# EasyEDA Pro project PCB.epro

# Board PCB2
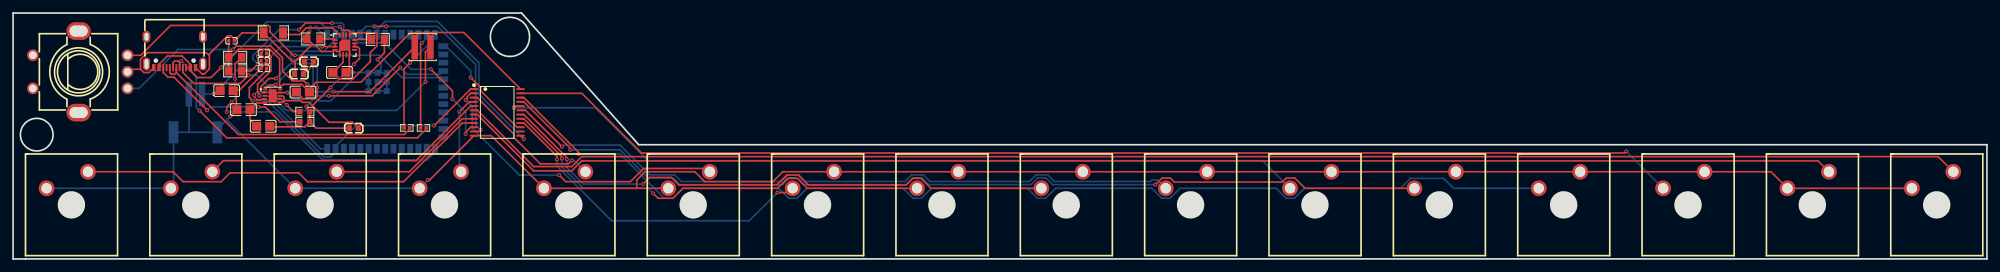
[diagram p0: board, top side]
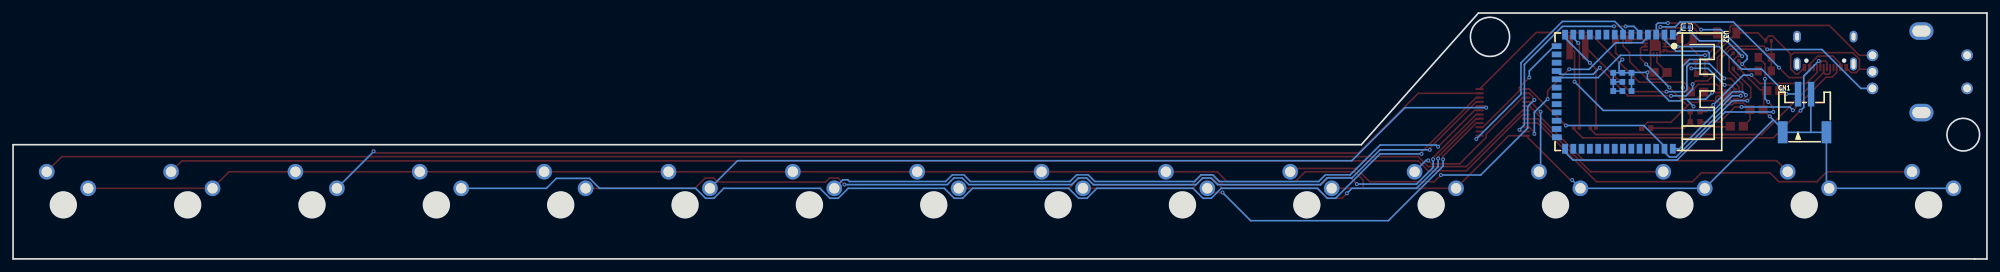
[diagram p1: board, bottom side, seen from below]

Outline 302.39 x 37.72 mm; copper layers: Top Layer, Bottom Layer. Coordinates in mm from the lower left corner of the outline.
Outline path: circle c3.63,19.06 r2.5 ; circle c76.13,34.06 r3 ; 0,37.72 0,0 1.91,0 1.91,0.01 302.39,0.01 302.39,17.53 95.84,17.53 77.9,37.72 0,37.72
Stack: Top Layer 0.035mm / Dielectric1 1.51mm FR4 er 4.5 / Bottom Layer 0.035mm

## Design rules (mm)
template: JLCPCB Capability(Two Layers Board)
spacing copperThickness1oz (default): track to track 0.102, other pairs 0.152 to 0.3
spacing copperThickness2oz: track to track 0.203, other pairs 0.152 to 0.3
track width copperThickness1oz (default): min 0.127, default 0.254, max 2.54
track width copperThickness2oz: min 0.203, default 0.254, max 2.54
differential pair differentialPair (default): width min 0.127, default 0.254, max 2.54; gap min 0.152, default 0.152
via viaSize (default): diameter min 0.5, default 0.61, max 10; hole min 0.3, default 0.305, max 6.3

## Placement (name value [footprint] x y rotation side)
C1  10uF  [C0805]  50 28.61 0 top
C3  22uF  [C0805]  32.73 25.82 0 top
C4  22uF  [C0805]  35.29 22.89 180 top
C5  10uF  [C0603]  52.2 20.07 0 top
C6  100nF  [C0805]  38.32 20.36 0 top
C7  10uF  [C0603]  45.33 30.25 180 top
C8  10uF  [C0603]  43.81 28.36 180 top
C9  1uF  [C0402]  38.43 30.4 0 top
C10  10uF  [C0805]  44.41 25.59 0 top
C11  100nF  [C0402]  45.97 35.56 0 bottom
C12  100nF  [C0402]  38.44 31.57 0 top
C13  100nF  [C0402]  33.46 33.46 0 top
C14  100nF  [C0402]  38.43 29.23 0 top
CN1  S2B-PH-SM4-TB(LF)(SN)  [CONN-SMD_P2.00_S2B-PH-SM4-TB-LF-SN]  27.94 22.35 180 bottom
L1  1.5uH  [IND-SMD_L4.0-W4.0-A]  62.74 32.51 0 top
R1  5.1kΩ  [R0603]  44.7 22.61 0 top
R2  5.1kΩ  [R0603]  44.7 21.03 0 top
R3  10kΩ  [R0805]  45.99 33.75 180 top
R4  3.09kΩ  [R0805]  55.88 33.67 0 top
R5  1.78kΩ  [R1206]  39.88 34.67 0 top
R6  10kΩ  [R0805]  34.04 28.85 180 top
R7  10kΩ  [R0805]  34.02 30.92 0 top
R8  22Ω  [R0402]  62.87 20.1 0 top
R9  22Ω  [R0402]  60.33 20.1 0 top
SW1  EC11E1834403  [SW-TH_EC11E1820402]  10.29 28.7 90 top
SW6  CPG1511F01S04  [KEY-TH_CPG1511F01S0X]  198.8 12.11 0 top
SW7  CPG1511F01S04  [KEY-TH_CPG1511F01S0X]  217.85 12.11 0 top
SW8  CPG1511F01S04  [KEY-TH_CPG1511F01S0X]  236.9 12.11 0 top
SW9  CPG1511F01S04  [KEY-TH_CPG1511F01S0X]  255.95 12.11 0 top
SW18  CPG1511F01S04  [KEY-TH_CPG1511F01S0X]  122.61 12.11 0 top
SW19  CPG1511F01S04  [KEY-TH_CPG1511F01S0X]  141.65 12.11 0 top
SW20  CPG1511F01S04  [KEY-TH_CPG1511F01S0X]  160.7 12.11 0 top
SW21  CPG1511F01S04  [KEY-TH_CPG1511F01S0X]  179.75 12.11 0 top
SW22  CPG1511F01S04  [KEY-TH_CPG1511F01S0X]  27.36 12.11 0 top
SW23  CPG1511F01S04  [KEY-TH_CPG1511F01S0X]  65.45 12.11 0 top
SW24  CPG1511F01S04  [KEY-TH_CPG1511F01S0X]  84.5 12.11 0 top
SW25  CPG1511F01S04  [KEY-TH_CPG1511F01S0X]  103.56 12.11 0 top
SW26  CPG1511F01S04  [KEY-TH_CPG1511F01S0X]  8.3 12.11 0 top
SW27  CPG1511F01S04  [KEY-TH_CPG1511F01S0X]  46.41 12.11 0 top
SW28  CPG1511F01S04  [KEY-TH_CPG1511F01S0X]  275 12.11 0 top
SW29  CPG1511F01S04  [KEY-TH_CPG1511F01S0X]  294.06 12.11 0 top
U17  CD74HC4067SM96  [SSOP-24_L8.1-W5.3-P0.65-LS7.8-BL]  74.17 22.48 270 top
U32  ESP32-S3-WROOM-1-N16R8  [WIRELM-SMD_ESP32-S3-WROOM-1]  57.02 25.65 270 bottom
U33  BQ24074RGTR  [QFN-16_L3.0-W3.0-P0.50-TL-EP1.7]  50.81 32.82 0 top
U34  TPS63031DSKR  [SON-10_L2.5-W2.5-P0.50-TL-EP]  39.75 25.02 0 top
USB1  TYPE-C 16PIN 2MD(073)  [USB-C-SMD_TYPE-C-6PIN-2MD-073]  24.77 31.72 180 top

## Footprints (pads in the part's own frame, mm; a bottom-side part is the same pattern mirrored in y, then rotated)
C0402
  rect 0.5x0.54 smd: 1(-0.42,0) 2(0.42,0)
C0603
  rect 0.8x0.9 smd: 1(-0.7,0) 2(0.7,0)
C0805
  rect 1.41x1.35 smd: 1(-1,0)
  rect 1.397x1.346 smd: 2(1,0)
CONN-SMD_P2.00_S2B-PH-SM4-TB-LF-SN
  rect 1x3.8 smd: 1(-1,2.925) 2(1,2.925)
  rect 1.5x3.4 smd: 3(3.35,-2.925) 4(-3.35,-2.925)
IND-SMD_L4.0-W4.0-A
  rect 1x3.8 smd: 1(-1.2,0) 2(1.2,0)
KEY-TH_CPG1511F01S0X
  round 2.4 hole 1.6: 1(-3.175,-1.27) 2(3.175,1.27)
QFN-16_L3.0-W3.0-P0.50-TL-EP1.7
  oval 0.85x0.28 smd: 1(-1.5,0.75) 2(-1.5,0.25) 3(-1.5,-0.25) 4(-1.5,-0.75) 9(1.5,-0.75) 10(1.5,-0.25) 11(1.5,0.25) 12(1.5,0.75)
  oval 0.28x0.85 smd: 5(-0.75,-1.5) 6(-0.25,-1.5) 7(0.25,-1.5) 8(0.75,-1.5) 13(0.75,1.5) 14(0.25,1.5) 15(-0.25,1.5) 16(-0.75,1.5)
  custom 1.7x1.7 smd: 17(0,0)
R0402
  rect 0.566x0.54 smd: 1(-0.433,0) 2(0.433,0)
R0603
  rect 0.806x0.864 smd: 1(-0.753,0) 2(0.753,0)
R0805
  rect 1.133x1.377 smd: 1(-1,0) 2(1,0)
R1206
  rect 1.208x1.701 smd: 1(-1.479,0) 2(1.479,0)
SON-10_L2.5-W2.5-P0.50-TL-EP
  rect 0.665x0.28 smd: 1(-1.157,1) 2(-1.157,0.5) 3(-1.157,0) 4(-1.157,-0.5) 5(-1.157,-1) 6(1.157,-1) 7(1.157,-0.5) 8(1.157,0) 9(1.157,0.5) 10(1.157,1)
  rect 1.2x2 smd: 11(0,0)
SSOP-24_L8.1-W5.3-P0.65-LS7.8-BL
  oval 0.308x1.324 smd: 1(-3.575,-3.562) 2(-2.925,-3.562) 3(-2.275,-3.562) 4(-1.625,-3.562) 5(-0.975,-3.562) 6(-0.325,-3.562) 7(0.325,-3.562) 8(0.975,-3.562) 9(1.625,-3.562) 10(2.275,-3.562) 11(2.925,-3.562) 12(3.575,-3.562) 13(3.575,3.562) 14(2.925,3.562) 15(2.275,3.562) 16(1.625,3.562) 17(0.975,3.562) 18(0.325,3.562) 19(-0.325,3.562) 20(-0.975,3.562) 21(-1.625,3.562) 22(-2.275,3.562) 23(-2.925,3.562) 24(-3.575,3.562)
SW-TH_EC11E1820402
  round 1.8 hole 1.2: A(-2.54,-7.25) B(2.54,-7.25) C(0,-7.25) D(-2.54,7.25) E(2.54,7.25)
  oval 2.7x3.7 hole 1.7x2.8: F(6.25,0.25) G(-6.25,0.25)
USB-C-SMD_TYPE-C-6PIN-2MD-073
  rect 0.55x1.1 smd: 1(-3.2,2.375) 2(-2.4,2.375) 11(2.4,2.375) 12(3.2,2.375)
  rect 0.3x1.1 smd: 3(-1.75,2.375) 4(-1.25,2.375) 5(-0.75,2.375) 6(-0.25,2.375) 7(0.25,2.375) 8(0.75,2.375) 9(1.25,2.375) 10(1.75,2.375)
  oval 1.1x2 hole 0.6x1.5: 13(-4.325,1.825) 14(4.325,1.825)
  oval 1.2x1.8 hole 0.6x1.2: 13(-4.325,-2.375) 14(4.325,-2.375)
WIRELM-SMD_ESP32-S3-WROOM-1
  rect 1.5x0.9 smd: 1(-8.75,8.895) 2(-8.75,7.625) 3(-8.75,6.355) 4(-8.75,5.085) 5(-8.75,3.815) 6(-8.75,2.545) 7(-8.75,1.275) 8(-8.75,0.005) 9(-8.75,-1.265) 10(-8.75,-2.535) 11(-8.75,-3.805) 12(-8.75,-5.075) 13(-8.75,-6.345) 14(-8.75,-7.615) 27(8.75,-7.615) 28(8.75,-6.345) 29(8.75,-5.075) 30(8.75,-3.805) 31(8.75,-2.535) 32(8.75,-1.265) 33(8.75,0.005) 34(8.75,1.275) 35(8.75,2.545) 36(8.75,3.815) 37(8.75,5.085) 38(8.75,6.355) 39(8.75,7.625) 40(8.75,8.895)
  rect 0.9x1.5 smd: 15(-6.985,-8.895) 16(-5.715,-8.895) 17(-4.445,-8.895) 18(-3.175,-8.895) 19(-1.905,-8.895) 20(-0.635,-8.895) 21(0.635,-8.895) 22(1.905,-8.895) 23(3.175,-8.895) 24(4.445,-8.895) 25(5.715,-8.895) 26(6.985,-8.865)
  rect 0.9x0.9 smd: 41(-2.9,-0.225) 41(-2.9,1.175) 41(-2.9,2.575) 41(-1.5,-0.225) 41(-1.5,1.175) 41(-1.5,2.575) 41(-0.1,-0.225) 41(-0.1,1.175) 41(-0.1,2.575)

## Nets
3V3: C10.2 C13.1 R6.2 R7.1 U17.24 U34.10
GND: C1.2 C3.2 C4.2 C5.1 C6.2 C8.2 C9.2 C11.1 C12.1 C13.2 C14.1 CN1.2 CN1.3 CN1.4 R1.2 R2.2 R3.2 R4.2 R5.1 SW1.C SW6.2 SW7.2 SW8.2 SW9.2 SW18.2 SW19.2 SW20.2 SW21.2 SW22.1 SW23.1 SW24.1 SW25.1 SW26.1 SW27.1 SW28.1 SW29.1 U17.12 U32.41 U33.4 U33.5 U33.8 U33.17 U34.7 U34.9 U34.11 USB1.1 USB1.12
VBAT: C3.1 CN1.1 U33.2 U33.3
VBUS_5V: C1.1 U33.6 U33.13 USB1.2 USB1.11
ADC1: C14.2 U17.1 U32.39
E#: U17.15 U32.15
S0: U17.10 U32.4
S1: U17.11 U32.5
S2: U17.14
S3: U17.13 U32.7
SYS_4V4: C4.1 C5.2 C6.1 U33.10 U33.11 U34.5 U34.6 U34.8
USB_D+: R9.2 USB1.6 USB1.8
USB_D-: R8.2 USB1.5 USB1.7
$1N6548: R1.1 USB1.4
$1N6587: R2.1 USB1.10
$1N7885: R3.1 U33.1
$1N8001: R4.1 U33.12
$1N8056: R5.2 U33.16
$1N9422: L1.2 U34.4
$1N9428: L1.1 U34.2
$1N9438: U34.3
$1N9444: C7.1 U34.1
$1N9768: C7.2 C8.1
$1N10076: C9.1 R6.1 U32.3
$1N10174: R7.2 U32.27
$1N11262: C10.1 U32.2
$1N11304: C11.2 U32.1
$1N11378: R8.1 U32.13
$1N11417: R9.1 U32.14
$1N11588: U32.6
$1N11672: C12.2 U32.40
$1N13367: SW1.A U32.18
$1N13382: SW1.B U32.19
$1N17155: SW26.2 U17.9
$1N17161: SW27.2 U17.8
$1N17168: SW28.2 U17.7
$1N17175: SW29.2 U17.6
$1N17188: SW25.2 U17.2
$1N17194: SW24.2 U17.3
$1N17201: SW23.2 U17.4
$1N17208: SW22.2 U17.5
$1N17215: SW9.1 U17.23
$1N17222: SW8.1 U17.22
$1N17229: SW7.1 U17.21
$1N17252: SW6.1 U17.20
$1N17260: SW21.1 U17.19
$1N17269: SW18.1 U17.16
$1N17275: SW19.1 U17.17
$1N17282: SW20.1 U17.18

Pads without a net: SW1 D E F G; U32 8 9 10 11 12 16 17 20 21 22 23 24 25 26 28 29 30 31 32 33 34 35 36 37 38; U33 7 9 14 15; USB1 3 9 13 14

## Via types
v1: diameter 0.61, hole 0.305, Top Layer to Bottom Layer, 67 vias

## Routing (per net, layer and track width the routed paths; a pad name or vN(x,y) marks a point on that pad's centre or on a via; arc(x,y) is an arc through that point)
3V3: length 63.4
  Top Layer w0.254: 33.04,31.16 33.04,33.46 ; 33.04,31.16 33.54,31.16 34.56,32.18 39.32,32.18 40.84,30.66 40.84,26.59 40.91,26.53 40.91,26.27 ; 33.04,31.16 33.04,30.91 ; 40.91,26.27 41.42,26.78 44.22,26.78 C10.2 45.41,26.1 46.43,27.11 53.29,27.11 60.91,34.73 69.05,34.73 U17.24 ; 40.91,26.27 U34.10 ; 33.04,30.91 R7.1 ; 33.04,30.91 R6.2
GND: length 458.7
  Top Layer w0.254: SW1.C 17.93,29.1 19.53,29.1 ; 95.55,10.84 95.55,12.11 96.82,13.38 104.44,13.38 105.97,11.85 116.38,11.85 117.91,13.38 SW18.2 SW19.2 SW20.2 SW21.2 SW6.2 SW7.2 SW8.2 SW9.2 269.29,13.38 SW28.1 SW29.1 ; 95.55,10.84 SW24.1 73.26,18.9 U17.12 63.81,12.11 v1(63.55,12.11) ; 95.55,10.84 SW25.1 ; v1(44.95,23.4) 44.95,23.11 R1.2 R2.2 ; v1(55.85,30.59) 56.88,31.62 R4.2 ; 50.03,31.83 50.03,31.35 50.06,31.32 ; 50.03,31.83 49.55,31.83 U33.4 49.05,31.82 47.28,31.82 46.26,32.83 46.01,32.83 ; 50.03,31.83 50.29,32.08 50.8,32.08 ; 34.2,25.93 34.2,22.99 C4.2 v1(33.28,21.88) ; 34.2,25.93 33.84,25.93 C3.2 ; 34.2,25.93 34.71,25.93 C14.1 38.01,29.31 38.77,30.07 38.77,30.32 ; 19.53,29.1 20.04,28.59 20.8,28.59 USB1.12 ; 19.53,29.1 19.53,30.62 20.55,31.64 29.61,31.64 30.07,31.18 ; 30.07,31.18 30.07,29.14 29.31,28.38 28.93,28.38 USB1.1 ; 30.07,31.18 30.07,31.43 32.87,34.22 33.37,34.22 33.88,33.72 C13.2 35.09,34.67 R5.1 42.78,30.29 43.21,30.29 ; U34.11 39.76,25.01 40.29,25.01 ; 38.77,30.32 38.77,30.58 38.27,31.08 38.01,31.08 ; 38.77,30.32 C9.2 ; v1(45.35,34.77) 45.09,34.51 45.09,33.75 ; 38.01,31.08 38.01,31.57 ; 38.01,31.08 v1(37.51,31.08) ; R2.2 44.7,20.27 39.4,20.27 C6.2 ; R2.2 46.42,20.07 C5.1 ; 46.01,32.83 45.09,33.75 ; 46.01,32.83 45.75,32.83 43.21,30.29 ; 45.09,33.75 R3.2 ; 43.21,30.29 43.21,28.46 C8.2 ; C1.2 51.51,29.12 ; 51.51,29.12 51.51,31.27 51.56,31.32 51.56,31.83 51.3,32.08 50.8,32.08 ; 51.51,29.12 v1(52.02,28.61) ; 50.8,32.08 50.8,32.81 U33.17 ; 40.29,25.01 40.29,24.76 40.54,24.5 40.89,24.5 U34.7 ; 40.29,25.01 40.29,25.37 40.44,25.52 U34.9 v1(42.07,25.52)
  Bottom Layer w0.254: U32.41 U32.41 U32.41 ; U32.41 54.39,28.61 v1(52.02,28.61) 52.02,27.59 48.67,24.25 46.89,24.25 46.64,24.5 45.88,24.5 ; U32.41 U32.41 56.36,28.55 ; 26.97,19.43 CN1.4 31.29,19.89 32.77,21.37 ; 26.97,19.43 26.97,25.25 CN1.2 ; 26.97,19.43 CN1.3 24.59,11.25 SW22.1 SW26.1 ; U32.41 U32.41 U32.41 ; U32.41 U32.41 ; U32.41 U32.41 56.36,28.55 ; 32.77,21.37 32.77,21.3 SW27.1 SW23.1 v1(63.55,12.11) ; 32.77,21.37 v1(33.28,21.88) ; 56.36,28.55 56.36,30.08 v1(55.85,30.59) ; v1(42.07,25.52) 43.08,24.5 45.88,24.5 ; 45.88,24.5 45.88,24.33 v1(44.95,23.4) ; v1(37.51,31.08) 39.87,33.45 44.03,33.45 45.55,34.97 C11.1
VBAT: length 25.1
  Top Layer w0.254: v1(47.37,32.57) 49.31,32.57 U33.2 ; C3.1 31.22,25.31 v1(30.71,25.31)
  Bottom Layer w0.254: CN1.1 28.97,25.31 v1(30.71,25.31) 34.52,29.12 37.57,29.12 41.02,32.57 v1(47.37,32.57)
VBUS_5V: length 56.6
  Top Layer w0.254: 50.56,31.32 50.56,30.17 C1.1 50.02,27.59 52.05,27.59 54.73,30.28 54.73,31.66 55.75,32.67 55.75,34.56 55.6,34.71 51.94,34.71 51.56,34.32 51.56,34.83 51.3,35.08 50.54,35.08 v1(50.03,35.59) ; 22.36,29.35 22.36,29.86 23.64,31.13 25.89,31.13 27.16,29.86 USB1.2 27.16,28.84 28.18,27.83 30.33,27.83 v1(31.85,29.35)
  Bottom Layer w0.254: v1(31.85,29.35) 38.86,36.35 46.99,36.35 47.75,35.59 v1(50.03,35.59)
ADC1: length 48.6
  Top Layer w0.254: v1(36.7,24.27) 36.19,24.78 36.19,26.3 38.85,28.97 C14.2 ; U17.1 70.1,26.05 v1(64.51,20.47)
  Bottom Layer w0.254: v1(64.51,20.47) 52.57,20.47 49.52,17.42 49.52,17.03 U32.39 49.4,16.4 48.64,15.63 47.62,15.63 38.98,24.27 v1(36.7,24.27)
E#: length 17.9
  Top Layer w0.254: v1(70.11,27.82) 71.63,26.3 71.63,25.79 77.22,20.2 U17.15
  Bottom Layer w0.254: U32.15 65.93,32.65 66.3,32.65 70.11,28.84 v1(70.11,27.82)
S0: length 28.4
  Top Layer w0.254: v1(67.3,24.52) 67.3,25.79 v1(64,29.09) ; U17.10 70.1,20.2 69.34,19.44 v1(69.34,19.19)
  Bottom Layer w0.254: U32.4 51.94,34.05 52.83,33.16 56.89,33.16 60.95,29.09 v1(64,29.09) ; v1(69.34,19.19) 69.34,22.49 v1(67.3,24.52)
S1: length 32.3
  Top Layer w0.254: U17.11 71.37,19.55 v1(71.62,19.81) ; v1(57.14,35.67) v1(55.37,35.67)
  Bottom Layer w0.254: U32.5 53.33,34.53 53.33,34.91 54.1,35.67 v1(55.37,35.67) ; v1(57.14,35.67) 65.02,35.67 70.86,29.83 70.86,20.57 v1(71.62,19.81)
S3: length 34.8
  Top Layer w0.254: U17.13 v1(78.24,18.4)
  Bottom Layer w0.254: v1(78.24,18.4) 71.38,25.25 71.38,30.08 65.03,36.43 57.01,36.43 55.75,35.17 U32.7
SYS_4V4: length 36.7
  Top Layer w0.254: 38.49,23.91 U34.5 ; 38.49,23.91 37.31,23.91 C4.1 36.29,21.38 C6.1 ; 38.49,23.91 38.74,23.91 38.99,23.66 40.52,23.66 40.77,23.91 40.77,24.02 41.28,24.02 41.53,24.27 ; 41.53,24.27 41.53,24.78 41.3,25.02 U34.8 ; 41.53,24.27 44.07,24.27 44.33,24.02 45.34,24.02 45.85,23.51 ; v1(52.2,29.86) 53.07,30.73 53.07,32.25 52.75,32.57 52.31,32.57 U33.11 ; 45.85,23.51 48.39,20.97 51.99,20.97 52.9,20.07 ; 45.85,23.51 v1(48.65,26.3)
  Bottom Layer w0.254: v1(48.65,26.3) v1(52.2,29.86)
USB_D+: length 42.9
  Top Layer w0.254: USB1.8 24.02,28.57 24.25,28.33 24.76,28.33 25.02,28.59 ; R9.2 60.76,19.93 59.92,19.09 34.52,19.09 25.02,28.59 ; 25.02,28.59 USB1.6
USB_D-: length 49.1
  Top Layer w0.254: USB1.5 25.52,30.11 ; 25.52,30.11 25.26,30.37 24.75,30.37 24.52,30.13 USB1.7 ; 25.52,30.11 v1(25.77,30.37) ; v1(28.56,22.75) 32.73,18.58 61.94,18.58 63.3,19.94 63.3,20.1
  Bottom Layer w0.254: v1(28.56,22.75) 28.05,23.25 28.05,28.08 v1(25.77,30.37)
$1N6548: length 22.2
  Top Layer w0.254: v1(41.92,23.62) 42.93,22.61 R1.1 ; USB1.4 26.02,28.6 27.69,26.92 34.81,26.92 v1(36.08,28.19)
  Bottom Layer w0.254: v1(36.08,28.19) 37.35,28.19 v1(41.92,23.62)
$1N6587: length 25.2
  Top Layer w0.254: v1(37.6,23.31) 38.62,23.31 40.9,21.03 43.95,21.03 ; v1(29.73,22.81) 24.65,27.89 23.72,27.89 23.02,28.59 USB1.10
  Bottom Layer w0.254: v1(37.6,23.31) 30.23,23.31 v1(29.73,22.81)
$1N7885: length 2.4
  Top Layer w0.254: R3.1 49.13,33.75 49.31,33.57
$1N8001: length 2.6
  Top Layer w0.254: R4.1 52.41,33.67 52.31,33.57
$1N8056: length 9.7
  Top Layer w0.254: 50.06,34.32 48.95,35.43 44.91,35.43 43.9,34.42 41.61,34.42 R5.2
$1N9422: length 37.3
  Top Layer w0.254: v1(36.93,25.15) 36.93,24.89 37.44,24.38 37.95,24.38 38.09,24.52 U34.4 ; v1(63.18,27.18) 63.18,31.75 L1.2
  Bottom Layer w0.254: v1(36.93,25.15) 37.44,25.65 38.97,25.65 41.84,22.78 58.78,22.78 v1(63.18,27.18)
$1N9428: length 33.2
  Top Layer w0.254: v1(40.25,27.69) 39.24,27.69 37.97,26.42 37.97,25.65 38.1,25.52 U34.2 ; L1.1 54.68,25.65 v1(49.09,25.65)
  Bottom Layer w0.254: v1(40.25,27.69) 42.54,29.97 45.54,29.97 45.97,29.54 45.97,25.98 46.3,25.65 v1(49.09,25.65)
$1N9444: length 9.3
  Top Layer w0.254: v1(40.19,26.69) 39.26,26.69 U34.1 ; C7.1 46.03,29.99 v1(45.27,29.23)
  Bottom Layer w0.254: v1(45.27,29.23) 42.73,29.23 v1(40.19,26.69)
$1N9768: length 1.9
  Top Layer w0.254: C8.1 44.63,28.48 C7.2
$1N10076: length 22.8
  Top Layer w0.254: R6.1 36.46,28.85 v1(37.5,29.89) C9.1 ; v1(43.79,35.17) 44.81,36.18 v1(48.87,36.18)
  Bottom Layer w0.254: v1(37.5,29.89) 36.74,30.65 36.74,31.16 40.74,35.17 v1(43.79,35.17) ; v1(48.87,36.18) 50.4,36.18 50.65,35.93 50.65,34.42 U32.3
$1N10174: length 45.3
  Top Layer w0.254: v1(32.74,22.54) 32.74,23.3 v1(33.5,24.07) ; R7.2 34.01,29.91 v1(34.01,27.62)
  Bottom Layer w0.254: v1(33.5,24.07) 34.01,24.57 v1(34.01,27.62) ; v1(32.74,22.54) 40.1,22.54 47.47,15.18 63.42,15.18 64.64,16.4 U32.27
$1N11262: length 22.2
  Top Layer w0.254: v1(46.6,26.28) 46.6,25.01 46.17,24.57 44.43,24.57 C10.1
  Bottom Layer w0.254: U32.2 49.4,33.64 47.62,31.86 42.79,31.86 42.54,31.61 42.54,30.85 42.79,30.59 45.59,30.59 46.6,29.58 v1(46.6,26.28)
$1N11304: length 2.2
  Bottom Layer w0.254: C11.2 47.55,34.4 U32.1
$1N11378: length 14.7
  Top Layer w0.254: v1(62.61,33.13) 62.44,32.97 R8.1
  Bottom Layer w0.254: v1(62.61,33.13) 63.37,33.9 U32.13
$1N11417: length 16.3
  Top Layer w0.254: R9.1 59.9,29.15 v1(60.83,30.09)
  Bottom Layer w0.254: v1(60.83,30.09) 64.64,33.9 U32.14
$1N11672: length 21.5
  Top Layer w0.254: v1(37.71,25.03) 37.71,25.29 37.46,25.54 37.46,26.81 39.49,28.84 39.49,30.93 C12.2
  Bottom Layer w0.254: U32.40 47.11,16.9 38.98,25.03 v1(37.71,25.03)
$1N13367: length 58.3
  Top Layer w0.254: v1(45.09,26.8) 44.58,27.3 42.8,27.3 41.28,28.83 41.28,30.86 39.5,32.64 34.17,32.64 v1(33.66,32.13) ; v1(59.31,29.34) 55,25.02 v1(48.39,25.02)
  Bottom Layer w0.254: v1(45.09,26.8) 45.09,26.03 46.11,25.02 v1(48.39,25.02) ; SW1.A 19.31,26.16 25.28,32.13 v1(33.66,32.13) ; U32.18 65.41,28.32 60.33,28.32 v1(59.31,29.34)
$1N13382: length 54.1
  Top Layer w0.254: SW1.B 19.56,31.24 24.14,35.81 39.12,35.81 39.38,35.56 39.38,34.8 42.93,31.24 v1(43.19,31.24)
  Bottom Layer w0.254: v1(43.19,31.24) 56.14,31.24 59.57,27.81 65.66,27.81 U32.19
$1N17155: length 64.6
  Top Layer w0.254: SW26.2 24.52,13.38 26.05,11.85 31.89,11.85 33.23,13.2 43.75,13.2 45.1,11.85 59.83,11.85 68.83,20.85 U17.9
$1N17161: length 24.4
  Top Layer w0.254: 49.58,13.38 60.7,13.38 68.83,21.5 U17.8
$1N17168: length 212.5
  Top Layer w0.254: SW28.2 276.52,15.04 87.12,15.04 85.59,13.52 79.75,13.52 71.11,22.15 U17.7
$1N17175: length 231.8
  Top Layer w0.254: SW29.2 294.92,15.69 87.12,15.69 85.59,14.17 79.75,14.17 71.11,22.8 U17.6
$1N17188: length 47.4
  Top Layer w0.254: SW25.2 106.22,13.89 96.6,13.89 94.57,11.85 84.66,11.85 v1(83.65,12.87) ; U17.2 70.1,25.4 69.59,24.9 69.59,24.64 v1(69.34,24.39)
  Bottom Layer w0.254: v1(69.34,24.39) 70.35,23.37 70.35,20.07 77.55,12.87 v1(83.65,12.87)
$1N17194: length 22.5
  Top Layer w0.254: U17.3 71.11,24.75 76.7,19.17 76.7,18.66 80.77,14.59 85.08,14.59 v1(85.59,15.1)
  Bottom Layer w0.254: SW24.2 85.96,15.1 v1(85.59,15.1)
$1N17201: length 12.2
  Top Layer w0.254: v1(68.38,22.58) 69.9,24.1 U17.4
  Bottom Layer w0.254: v1(68.38,22.58) 68.38,13.63 SW23.2
$1N17208: length 44.2
  Top Layer w0.254: U17.5 70.1,23.45 61.72,15.07 32.23,15.07 SW22.2
$1N17215: length 181.3
  Top Layer w0.254: U17.23 87.13,25.4 96.27,16.26 246.89,16.26 v1(247.15,16.51)
  Bottom Layer w0.254: SW9.1 247.15,16.47 v1(247.15,16.51)
$1N17222: length 170.8
  Top Layer w0.254: v1(86.62,16.12) 86.62,16.37 78.24,24.75 U17.22
  Bottom Layer w0.254: v1(86.62,16.12) 92.97,16.12 99.77,9.31 101.04,9.31 102.57,10.84 117.3,10.84 118.82,9.31 120.09,9.31 121.62,10.84 136.35,10.84 137.87,9.31 139.14,9.31 140.67,10.84 155.4,10.84 156.92,9.31 158.19,9.31 159.72,10.84 174.45,10.84 175.97,9.31 177.24,9.31 178.77,10.84 193.5,10.84 195.02,9.31 196.29,9.31 197.82,10.84 212.55,10.84 214.07,12.36 219.15,12.36 220.68,10.84 SW8.1
$1N17229: length 146.5
  Top Layer w0.254: U17.21 78.24,24.1 85.35,16.99 v1(85.35,16.74) ; v1(175.01,11.4) 176.03,12.42 177.3,12.42 177.92,11.79 194.45,11.79 195.08,12.42 196.35,12.42 197.93,10.84 SW7.1
  Bottom Layer w0.254: v1(85.35,16.74) 92.97,16.74 97.29,12.42 101.1,12.42 102.11,11.4 117.86,11.4 118.88,12.42 120.15,12.42 121.16,11.4 136.91,11.4 137.93,12.42 139.2,12.42 140.21,11.4 155.96,11.4 156.98,12.42 158.25,12.42 159.26,11.4 v1(175.01,11.4)
$1N17252: length 125.2
  Top Layer w0.254: U17.20 76.97,23.45 v1(76.71,23.2)
  Bottom Layer w0.254: v1(76.71,23.2) 89.16,23.2 97.29,15.07 191.4,15.07 SW6.1
$1N17260: length 106.8
  Top Layer w0.254: v1(84.08,17.22) 78.49,22.8 U17.19
  Bottom Layer w0.254: SW21.1 175.28,12.14 174.5,12.14 174.25,11.88 159.52,11.88 158.5,12.9 156.72,12.9 155.71,11.88 140.47,11.88 139.45,12.9 137.67,12.9 136.66,11.88 121.42,11.88 120.4,12.9 118.62,12.9 117.61,11.88 102.37,11.88 101.35,12.9 97.54,12.9 92.97,17.47 84.33,17.47 v1(84.08,17.22)
$1N17269: length 50.9
  Top Layer w0.254: v1(117.1,10.19) 118.78,10.19 SW18.1 ; U17.16 78.24,20.85 83.32,15.77 v1(83.32,15.27)
  Bottom Layer w0.254: v1(83.32,15.27) 83.32,14.25 91.7,5.87 112.78,5.87 v1(117.1,10.19)
$1N17275: length 68.6
  Top Layer w0.254: v1(98.05,10.07) 98.81,9.31 101.1,9.31 102.62,10.84 117.1,10.84 118.62,12.36 120.15,12.36 121.67,10.84 SW19.1 ; U17.17 78.24,21.5 84.08,15.66 v1(84.08,15.41)
  Bottom Layer w0.254: v1(84.08,15.41) 84.08,14.14 87.38,10.84 97.29,10.84 v1(98.05,10.07)
$1N17282: length 88.3
  Top Layer w0.254: U17.18 78.24,22.15 84.84,15.55 v1(84.84,15.3) ; SW20.1 140.61,10.84 139.08,12.36 137.81,12.36 136.8,11.35 121.81,11.35 120.29,12.87 118.51,12.87 116.99,11.35 102,11.35 100.84,12.5 97.54,12.5 v1(96.53,11.49)
  Bottom Layer w0.254: v1(96.53,11.49) 87.38,11.49 84.84,14.03 v1(84.84,15.3)
